# EAGLE design Board (EAGLE 7.1.0)
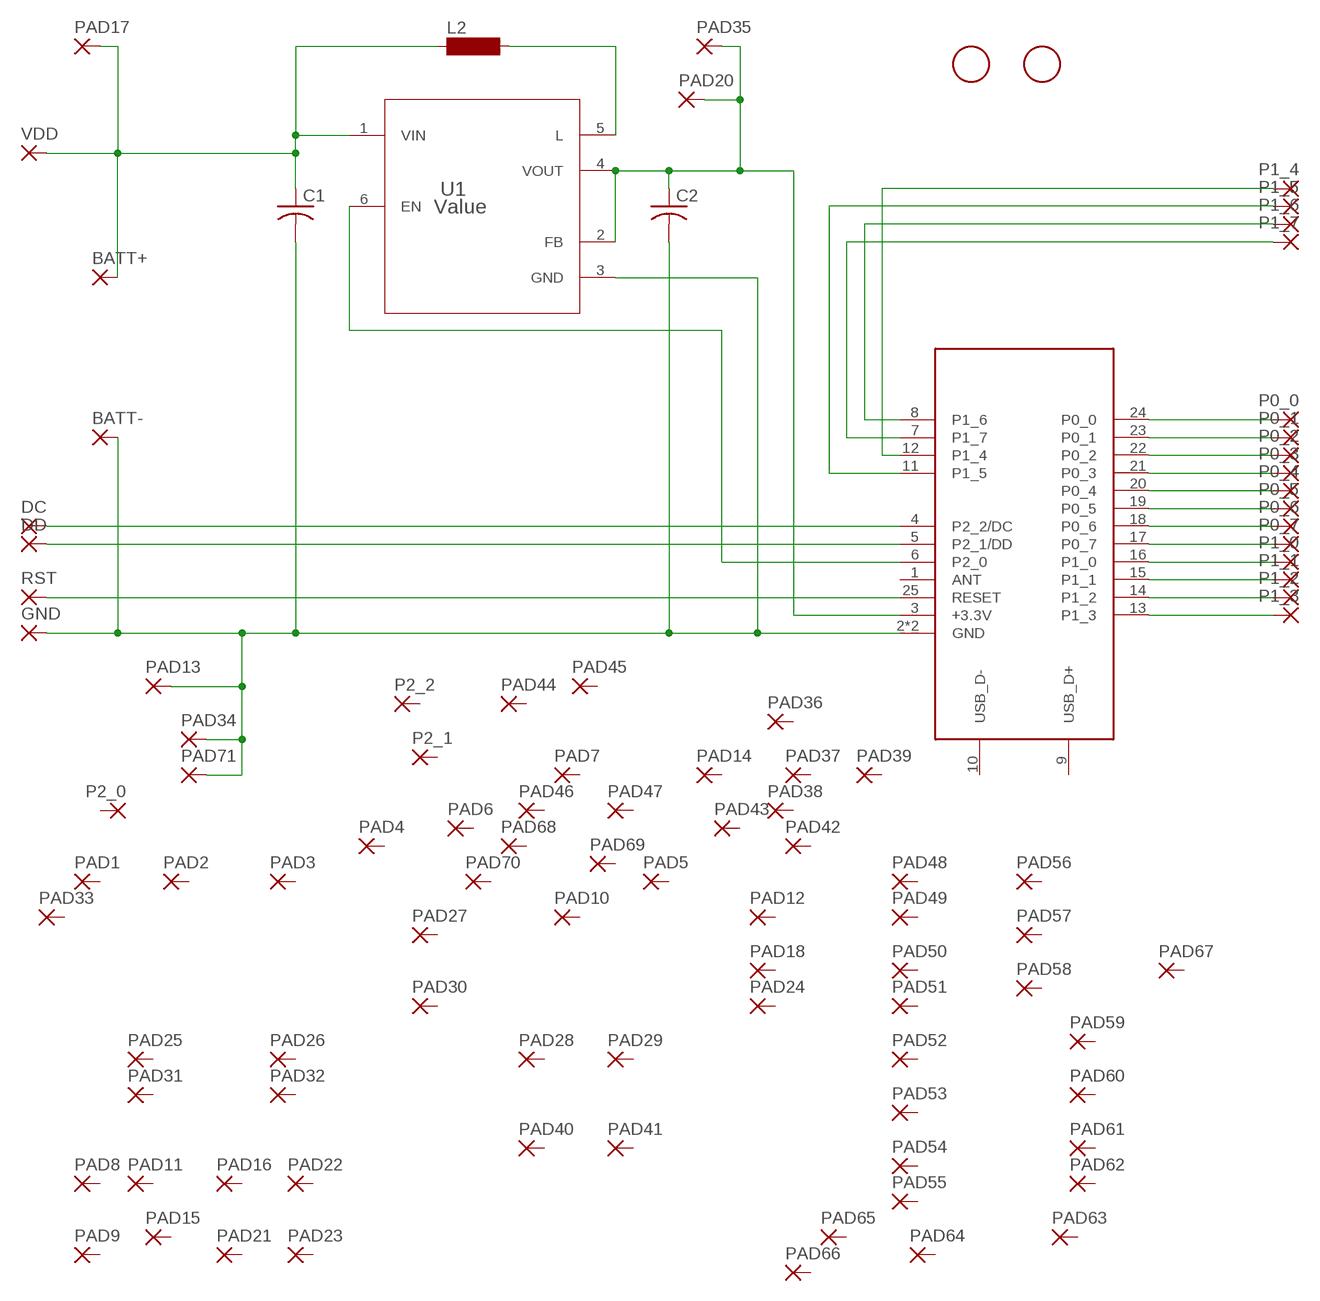
[diagram p0: schematic, sheet 1]

## Parts
BATT+  1,6/0,9  [1,6/0,9]
BATT-  1,6/0,9  [1,6/0,9]
C1  C-USC0603  [C0603]
C2  C-USC0603  [C0603]
DC  SMD2  [SMD1,27-2,54]
DD  SMD2  [SMD1,27-2,54]
E1  CC2540-MODULE-BOARD  [24X15_BOARD]
GND  SMD2  [SMD1,27-2,54]
L2  SM-NE29  [SM-NE29]
P0_0  1,6/0,9  [1,6/0,9]
P0_1  1,6/0,9  [1,6/0,9]
P0_2  1,6/0,9  [1,6/0,9]
P0_3  1,6/0,9  [1,6/0,9]
P0_4  1,6/0,9  [1,6/0,9]
P0_5  1,6/0,9  [1,6/0,9]
P0_6  1,6/0,9  [1,6/0,9]
P0_7  1,6/0,9  [1,6/0,9]
P1_0  1,6/0,9  [1,6/0,9]
P1_1  1,6/0,9  [1,6/0,9]
P1_2  1,6/0,9  [1,6/0,9]
P1_3  1,6/0,9  [1,6/0,9]
P1_4  1,6/0,9  [1,6/0,9]
P1_5  1,6/0,9  [1,6/0,9]
P1_6  1,6/0,9  [1,6/0,9]
P1_7  1,6/0,9  [1,6/0,9]
P2_0  1,6/0,9  [1,6/0,9]
P2_1  1,6/0,9  [1,6/0,9]
P2_2  1,6/0,9  [1,6/0,9]
PAD1  1,6/0,9  [1,6/0,9]
PAD2  1,6/0,9  [1,6/0,9]
PAD3  1,6/0,9  [1,6/0,9]
PAD4  1,6/0,9  [1,6/0,9]
PAD5  1,6/0,9  [1,6/0,9]
PAD6  1,6/0,9  [1,6/0,9]
PAD7  1,6/0,9  [1,6/0,9]
PAD8  1,6/0,9  [1,6/0,9]
PAD9  1,6/0,9  [1,6/0,9]
PAD10  1,6/0,9  [1,6/0,9]
PAD11  1,6/0,9  [1,6/0,9]
PAD12  1,6/0,9  [1,6/0,9]
PAD13  1,6/0,9  [1,6/0,9]
PAD14  1,6/0,9  [1,6/0,9]
PAD15  1,6/0,9  [1,6/0,9]
PAD16  1,6/0,9  [1,6/0,9]
PAD17  1,6/0,9  [1,6/0,9]
PAD18  1,6/0,9  [1,6/0,9]
PAD20  1,6/0,9  [1,6/0,9]
PAD21  1,6/0,9  [1,6/0,9]
PAD22  1,6/0,9  [1,6/0,9]
PAD23  1,6/0,9  [1,6/0,9]
PAD24  1,6/0,9  [1,6/0,9]
PAD25  1,6/0,9  [1,6/0,9]
PAD26  1,6/0,9  [1,6/0,9]
PAD27  1,6/0,9  [1,6/0,9]
PAD28  1,6/0,9  [1,6/0,9]
PAD29  1,6/0,9  [1,6/0,9]
PAD30  1,6/0,9  [1,6/0,9]
PAD31  1,6/0,9  [1,6/0,9]
PAD32  1,6/0,9  [1,6/0,9]
PAD33  1,6/0,9  [1,6/0,9]
PAD34  1,6/0,9  [1,6/0,9]
PAD35  1,6/0,9  [1,6/0,9]
PAD36  1,6/0,9  [1,6/0,9]
PAD37  1,6/0,9  [1,6/0,9]
PAD38  1,6/0,9  [1,6/0,9]
PAD39  1,6/0,9  [1,6/0,9]
PAD40  1,6/0,9  [1,6/0,9]
PAD41  1,6/0,9  [1,6/0,9]
PAD42  1,6/0,9  [1,6/0,9]
PAD43  1,6/0,9  [1,6/0,9]
PAD44  1,6/0,9  [1,6/0,9]
PAD45  1,6/0,9  [1,6/0,9]
PAD46  1,6/0,9  [1,6/0,9]
PAD47  1,6/0,9  [1,6/0,9]
PAD48  1,6/0,9  [1,6/0,9]
PAD49  1,6/0,9  [1,6/0,9]
PAD50  1,6/0,9  [1,6/0,9]
PAD51  1,6/0,9  [1,6/0,9]
PAD52  1,6/0,9  [1,6/0,9]
PAD53  1,6/0,9  [1,6/0,9]
PAD54  1,6/0,9  [1,6/0,9]
PAD55  1,6/0,9  [1,6/0,9]
PAD56  1,6/0,9  [1,6/0,9]
PAD57  1,6/0,9  [1,6/0,9]
PAD58  1,6/0,9  [1,6/0,9]
PAD59  1,6/0,9  [1,6/0,9]
PAD60  1,6/0,9  [1,6/0,9]
PAD61  1,6/0,9  [1,6/0,9]
PAD62  1,6/0,9  [1,6/0,9]
PAD63  1,6/0,9  [1,6/0,9]
PAD64  1,6/0,9  [1,6/0,9]
PAD65  1,6/0,9  [1,6/0,9]
PAD66  1,6/0,9  [1,6/0,9]
PAD67  1,6/0,9  [1,6/0,9]
PAD68  1,6/0,9  [1,6/0,9]
PAD69  1,6/0,9  [1,6/0,9]
PAD70  1,6/0,9  [1,6/0,9]
PAD71  1,6/0,9  [1,6/0,9]
RST  SMD2  [SMD1,27-2,54]
U1  Value  TPS61221DCKR  [DCK0006A]
U$1  FIDUCIAL  [FIDUCIAL_1MM]
U$2  FIDUCIAL  [FIDUCIAL_1MM]
VDD  SMD2  [SMD1,27-2,54]

## Nets
3V3: C2.1 E1.3(+3.3V) PAD20.1(P) PAD35.1(P) U1.2(FB) U1.4(VOUT)
DC: DC.1(P) E1.4(P2_2/DC)
DD: DD.1(P) E1.5(P2_1/DD)
GND: BATT-.1(P) C1.2 C2.2 E1.2(GND) E1.26(GND) GND.1(P) PAD13.1(P) PAD34.1(P) PAD71.1(P) U1.3(GND)
N$1: E1.18(P0_6) P0_6.1(P)
N$2: E1.17(P0_7) P0_7.1(P)
N$6: E1.13(P1_3) P1_3.1(P)
N$7: E1.14(P1_2) P1_2.1(P)
N$8: E1.15(P1_1) P1_1.1(P)
N$9: E1.21(P0_3) P0_3.1(P)
N$10: E1.20(P0_4) P0_4.1(P)
N$11: E1.19(P0_5) P0_5.1(P)
N$12: E1.16(P1_0) P1_0.1(P)
N$13: E1.7(P1_7) P1_7.1(P)
N$14: E1.8(P1_6) P1_6.1(P)
N$15: E1.11(P1_5) P1_5.1(P)
N$16: E1.12(P1_4) P1_4.1(P)
N$17: E1.6(P2_0) U1.6(EN)
N$18: E1.22(P0_2) P0_2.1(P)
N$22: L2.2 U1.5(L)
P0_0: E1.24(P0_0) P0_0.1(P)
P0_1: E1.23(P0_1) P0_1.1(P)
RST: E1.25(RESET) RST.1(P)
VDD: BATT+.1(P) C1.1 L2.1 PAD17.1(P) U1.1(VIN) VDD.1(P)
Unconnected: E1.1(ANT) E1.9(USB_D+) E1.10(USB_D-) P2_0.1(P) P2_1.1(P) P2_2.1(P) PAD1.1(P) PAD2.1(P) PAD3.1(P) PAD4.1(P) PAD5.1(P) PAD6.1(P) PAD7.1(P) PAD8.1(P) PAD9.1(P) PAD10.1(P) PAD11.1(P) PAD12.1(P) PAD14.1(P) PAD15.1(P) PAD16.1(P) PAD18.1(P) PAD21.1(P) PAD22.1(P) PAD23.1(P) PAD24.1(P) PAD25.1(P) PAD26.1(P) PAD27.1(P) PAD28.1(P) PAD29.1(P) PAD30.1(P) PAD31.1(P) PAD32.1(P) PAD33.1(P) PAD36.1(P) PAD37.1(P) PAD38.1(P) PAD39.1(P) PAD40.1(P) PAD41.1(P) PAD42.1(P) PAD43.1(P) PAD44.1(P) PAD45.1(P) PAD46.1(P) PAD47.1(P) PAD48.1(P) PAD49.1(P) PAD50.1(P) PAD51.1(P) PAD52.1(P) PAD53.1(P) PAD54.1(P) PAD55.1(P) PAD56.1(P) PAD57.1(P) PAD58.1(P) PAD59.1(P) PAD60.1(P) PAD61.1(P) PAD62.1(P) PAD63.1(P) PAD64.1(P) PAD65.1(P) PAD66.1(P) PAD67.1(P) PAD68.1(P) PAD69.1(P) PAD70.1(P)

## Library data of the parts
BATT+ BATT- P0_0 P0_1-P0_7 P1_0 P1_1-P1_7 P2_0 P2_1 P2_2 PAD1-PAD18 PAD20-PAD71 = pads:1,6/0,9: THROUGH-HOLE PAD
C1 C2 = Copies:C-US: CAPACITOR, American symbol
DC DD GND RST VDD = pads:SMD2: SMD PAD
E1 = CC254X-Modules:CC2540-MODULE: TI CC2541 Module
L2 = NR3015T4R7M:SM-NE29: INDUCTOR SMD chip inductor; OC_FARNELL: unknown; OC_NEWARK: unknown
U1 = tps61221:TPS61221DCKR; COMPTYPE: IC; MANUFACTURER: Texas Instruments; MOUNTTYPE: SMT; PACKAGEREFERENCE: DCK0006A; PARTNUMBER: TPS61221DCK; PIN_COUNT: 6; REFDES: RefDes; ROHS: Y; TYPE: TYPE
U$1 U$2 = Copies:FIDUCIAL: For use by pick and place machines to calibrate the vision/machine, 1mm By microbuilder.eu

## Board
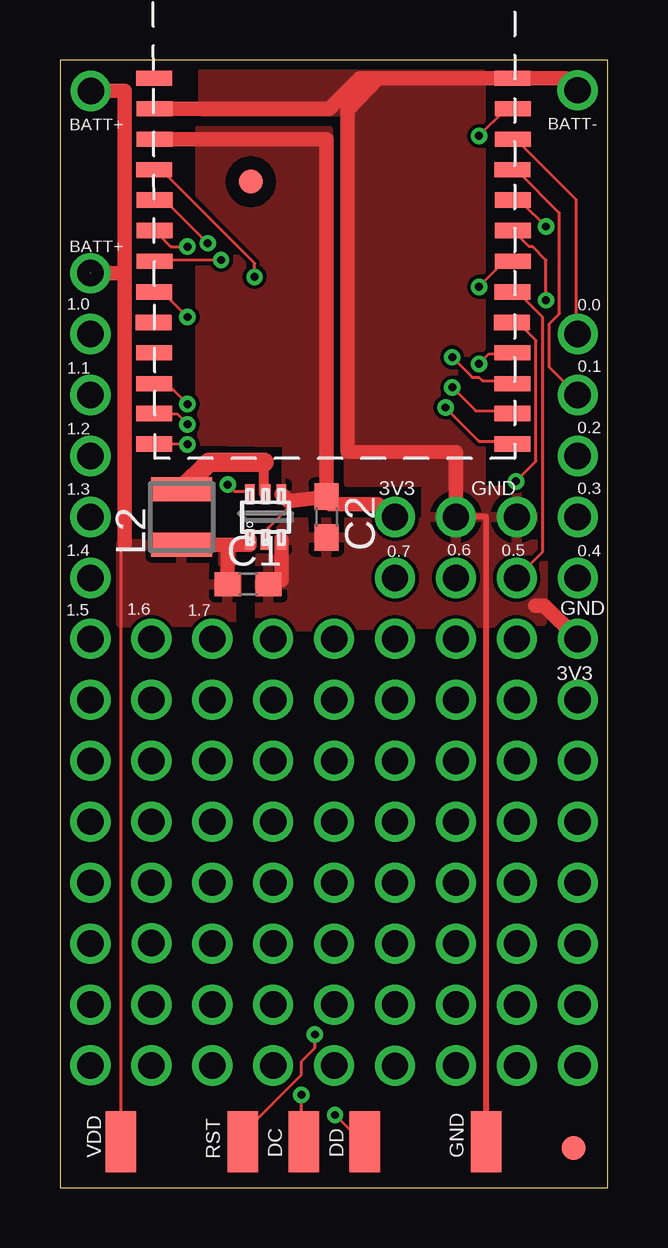
[diagram p1: board, top side]
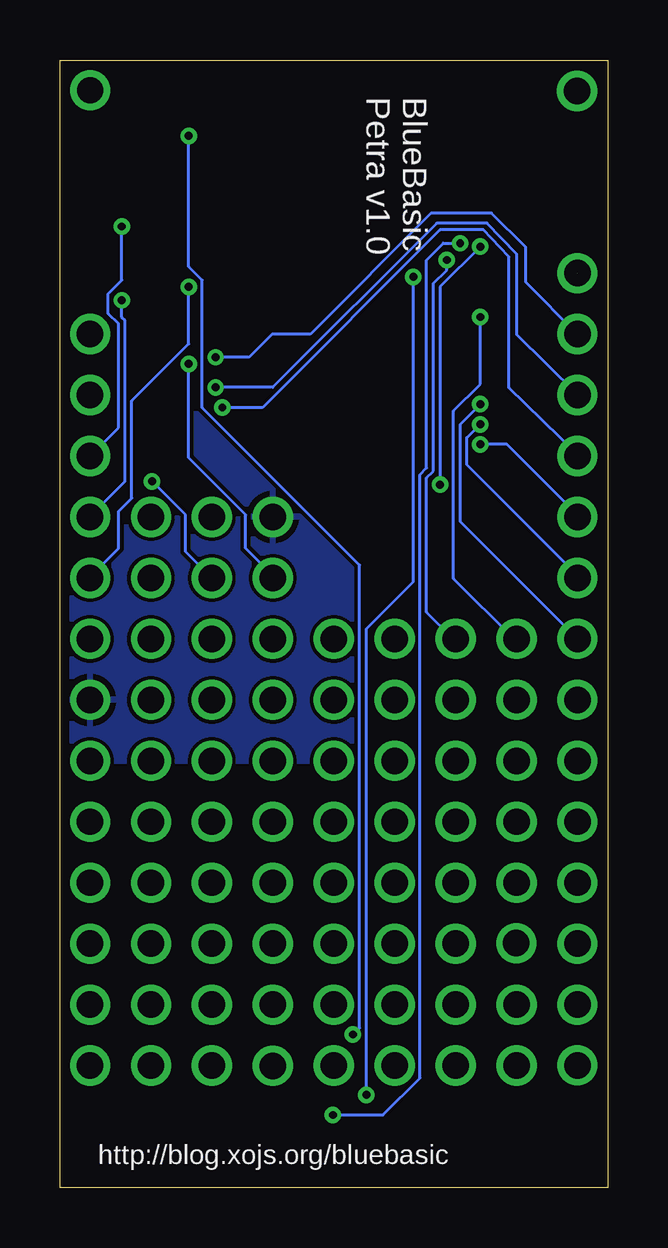
[diagram p2: board, bottom side, seen from below]

Size 22.85 x 46.98 mm. Coordinates in mm from the lower left corner, seen from the top.
Outline: 0,0 22.85,0 22.85,46.98 0,46.98 0,0
Copper layers (1*16): Top 0.0356mm / dielectric 1.5011mm / Bottom 0.0356mm
Design rules "LaenPCBOrder *": minimum track width 5mil, minimum drill 13mil, track to track 6mil, track to pad 6mil, pad to pad 6mil, via to via 6mil, smd to smd 6mil, copper to edge 15mil, drill to drill 6mil, minimum pad ring 7mil, minimum via ring 7mil, stop-mask expansion 3mil, vias tented up to drill 0.4mm, thermal gap 10mil
vRestrict: area 0.2,7.5 to 22.6,26.8

### Footprints (pad centres in the part's own frame; a part is rotated, then mirrored left to right if it is on the bottom)
1,6/0,9 = drill 1.1 pad 1.676: 1 0,0
C0603 = smd 1.1 x 1: 1 -0.85,0; 2 0.85,0
SMD1,27-2,54 = smd 1.27 x 2.54: 1 0,0
24X15_BOARD = smd 1.5 x 0.635: 1 -6.982,-1.16; 2 -6.973,-2.43; 3 -6.973,-3.7; 4 -6.982,-4.97; 5 -6.973,-6.23; 6 -6.973,-7.51; 7 -6.973,-8.79; 8 -6.982,-10.07; 9 -7.003,-11.34; 10 -6.982,-12.6; 11 -6.982,-13.89; 12 -6.982,-15.13; 13 -6.982,-16.4; 14 7.957,-16.4; 15 7.957,-15.13; 16 7.957,-13.89; 17 7.957,-12.6; 18 7.938,-11.34; 19 7.957,-10.07; 20 7.968,-8.79; 21 7.968,-7.51; 22 7.968,-6.23; 23 7.957,-4.97; 24 7.968,-3.7; 25 7.968,-2.43; 26 7.957,-1.16
SM-NE29 = smd 1 x 2.54: 1 -1.15,0; 2 1.15,0
DCK0006A = smd 0.838 x 0.406: 1 -0.94,0.66; 2 -0.94,0; 3 -0.94,-0.66; 4 0.94,-0.66; 5 0.94,0; 6 0.94,0.66
FIDUCIAL_1MM = smd 1 x 1: 1 0,0

### Placement (x,y rotation side)
BATT+  1.28,45.69 0 bottom
BATT-  21.59,45.72 0 bottom
C1  7.85,25.13 0 top
C2  11.11,27.94 270 top
DC  10.16,1.9 0 top
DD  12.7,1.9 0 top
E1  10.91,47.38 0 top
GND  17.78,1.9 0 top
L2  5.08,27.94 90 top
P0_0  21.59,35.56 0 top
P0_1  21.59,33.02 0 top
P0_2  21.59,30.48 0 top
P0_3  21.59,27.94 0 top
P0_4  21.59,25.4 0 top
P0_5  19.05,25.4 0 top
P0_6  16.51,25.4 0 top
P0_7  13.97,25.4 0 top
P1_0  1.27,35.56 0 top
P1_1  1.27,33.02 0 top
P1_2  1.27,30.48 180 top
P1_3  1.27,27.94 0 top
P1_4  1.27,25.4 0 top
P1_5  1.27,22.86 0 top
P1_6  3.81,22.86 0 top
P1_7  6.35,22.86 0 top
P2_0  16.51,12.7 0 top
P2_1  13.97,7.62 0 top
P2_2  19.05,20.32 0 top
PAD1  6.35,12.7 0 top
PAD2  8.89,12.7 0 top
PAD3  11.43,12.7 0 top
PAD4  13.97,12.7 0 top
PAD5  1.27,12.7 0 top
PAD6  13.97,10.16 0 top
PAD7  3.81,12.7 0 top
PAD8  6.35,7.62 0 top
PAD9  3.81,20.32 0 top
PAD10  1.27,17.78 0 top
PAD11  6.35,20.32 0 top
PAD12  11.43,10.16 0 top
PAD13  16.51,27.94 0 top
PAD14  19.05,17.78 0 top
PAD15  8.89,20.32 0 top
PAD16  21.59,17.78 0 top
PAD17  1.27,38.1 0 top
PAD18  1.27,15.24 0 top
PAD20  21.59,20.32 0 top
PAD21  16.51,22.86 0 top
PAD22  1.27,10.16 0 top
PAD23  11.43,5.08 0 top
PAD24  8.89,7.62 0 top
PAD25  11.43,7.62 0 top
PAD26  8.89,22.86 0 top
PAD27  16.51,7.62 0 top
PAD28  3.81,17.78 0 top
PAD29  8.89,17.78 0 top
PAD30  19.05,22.86 0 top
PAD31  3.81,15.24 0 top
PAD32  6.35,17.78 0 top
PAD33  11.43,22.86 0 top
PAD34  19.05,27.94 0 top
PAD35  13.97,27.94 0 top
PAD36  3.82,10.18 0 top
PAD37  1.27,5.09 0 top
PAD38  3.81,7.62 0 top
PAD39  3.81,5.08 0 top
PAD40  6.35,15.24 0 top
PAD41  8.89,15.24 0 top
PAD42  1.27,7.62 0 top
PAD43  13.97,5.07 0 top
PAD44  19.05,5.08 0 top
PAD45  19.05,7.62 0 top
PAD46  19.05,10.16 0 top
PAD47  21.59,12.7 0 top
PAD48  21.59,15.24 90 top
PAD49  16.51,5.08 90 top
PAD50  1.27,20.32 90 top
PAD51  13.97,22.86 90 top
PAD52  16.51,20.32 90 top
PAD53  16.51,17.78 90 top
PAD54  16.51,15.24 90 top
PAD55  6.35,5.08 90 top
PAD56  19.05,15.24 0 top
PAD57  19.05,12.7 0 top
PAD58  8.89,5.08 0 top
PAD59  8.89,10.16 90 top
PAD60  13.97,20.32 90 top
PAD61  13.97,17.78 90 top
PAD62  13.97,15.24 90 top
PAD63  16.51,10.16 90 top
PAD64  6.35,10.16 90 top
PAD65  11.43,20.32 90 top
PAD66  11.43,17.78 90 top
PAD67  11.43,15.24 90 top
PAD68  21.59,10.16 0 top
PAD69  21.59,7.62 0 top
PAD70  21.59,5.08 0 top
PAD71  21.59,22.86 0 top
RST  7.62,1.9 0 top
U1  8.57,27.94 90 top
U$1  7.96,41.91 0 top
U$2  21.42,1.65 0 top
VDD  2.54,1.9 0 top

### Tracks (layer width: path | path; a pad name or v marks a point on that pad's centre or on a via)
3V3
  Top 0.127: U1.2 8.67,27.05 8.67,27.47 9.51,28.31 9.52,28.59
  Top 0.61: E1.3 11.11,43.68 C2.1 | C2.1 11.27,28.48 13.27,28.48 13.77,27.98 PAD35.1 | C2.1 9.52,28.59 U1.4
  pour Top: 5.81,44.04 5.81,31.05 8.18,31.01 9.43,30.99 9.39,28.6 11.2,28.57 11.23,44.08 5.77,44.08
  pour Bottom: 8.89,33.02 22.77,33.02 22.77,17.78 8.87,17.78
DC  (via drill 0.33)
  Top 0.127: v8.12,37.95 8.12,38.51 4.34,42.28 4.06,42.28 E1.4 | v10.07,3.86 10.07,1.9 DC.1
  Bottom 0.127: v8.12,37.95 8.12,25.23 10.07,23.28 v10.07,3.86
DD  (via drill 0.33)
  Top 0.127: v6.16,39.34 4.48,41.02 4.06,41.02 E1.5 | v11.47,3.02 12.59,1.9 DD.1
  Bottom 0.127: v6.16,39.34 6.86,39.34 7.56,38.65 7.56,29.98 7.84,29.7 7.84,4.56 9.37,3.02 v11.47,3.02
GND
  Top 0.254: GND.1 17.78,27.94 PAD13.1
  Top 0.61: 13.27,46.22 E1.26 21.09,46.22 BATT-.1 | 13.27,46.22 12.51,46.22 11.24,44.95 E1.2 | PAD13.1 16.51,30.64 11.98,30.65 11.98,44.88 13.27,46.22 | U1.3 9.23,25.3 C1.2 | PAD71.1 20.2,24.25 19.83,24.25
  pour Top: 15.25,29.03 15.25,27.69 8.34,27.71 8.33,23.34 20.11,23.58 20.24,29.03
  pour Top: 5.96,46.48 17.6,46.48 17.6,26.82 15.2,26.82 15.28,29.34 11.98,29.34 11.9,44.78 5.93,44.78 5.93,46.52
N$1  (via drill 0.33)
  Top 0.127: v19.01,29.43 19.85,30.26 19.85,35.29 19.15,35.99 18.87,35.99 E1.18
  Bottom 0.127: v19.01,29.43 17.61,28.03 17.61,26.49 16.64,25.51 P0_6.1
N$2  (via drill 0.33)
  Top 0.127: v17.47,34.31 17.89,34.73 18.73,34.73 E1.17
  Bottom 0.127: v17.47,34.31 17.47,30.4 15.1,28.03 15.1,26.63 13.98,25.51 P0_7.1
N$6  (via drill 0.33)
  Top 0.127: v5.32,30.96 4.06,30.96 E1.13
  Bottom 0.127: v5.32,30.96 4.2,30.96 1.27,28.03 P1_3.1
N$7  (via drill 0.33)
  Top 0.127: v16.08,32.5 17.47,31.1 18.73,31.1 E1.14
  Bottom 0.127: v16.08,32.5 14.4,32.5 7,39.9 5.18,39.9 4.13,38.78 4.13,33.33 1.27,30.54 P1_2.1
N$8  (via drill 0.33)
  Top 0.127: v16.36,33.34 17.34,32.36 18.73,32.36 E1.15
  Bottom 0.127: v16.36,33.34 13.98,33.34 7.14,40.18 5.04,40.18 3.8,38.89 3.8,35.54 1.27,33.06 P1_1.1
N$9  (via drill 0.33)
  Top 0.127: v20.27,36.97 20.27,38.65 19.71,39.2 19.57,39.2 19.01,39.76 E1.21
  Bottom 0.127: v20.27,36.97 20.27,36.27 20.13,36.13 20.13,29.43 21.53,28.03 P0_3.1
N$10  (via drill 0.33)
  Top 0.127: 18.77,38.48 E1.20 18.73,38.51 18.45,38.51 v17.47,37.53 | 21.52,25.48 P0_4.1
  Bottom 0.127: v17.47,37.53 17.47,35.15 19.85,32.78 19.85,28.73 20.41,28.17 20.41,26.63 21.53,25.51 P0_4.1
N$11
  Top 0.127: E1.19 18.87,37.25 19.15,37.25 20.13,36.27 20.13,26.49 19.15,25.51 P0_5.1
N$12  (via drill 0.33)
  Top 0.127: v16.36,34.59 17.2,33.76 17.47,33.76 17.61,33.62 18.73,33.62 E1.16
  Bottom 0.127: P1_0.1 3.43,37.72 3.43,39.18 4.85,40.6 7.37,40.6 12.41,35.56 13.97,35.56 13.98,35.57 14.96,34.59 v16.36,34.59
N$13  (via drill 0.33)
  Top 0.127: v6.72,38.65 4.06,38.65 E1.7
  Bottom 0.127: v6.72,38.65 6.72,38.23 7.28,37.67 7.28,29.84 7.56,29.57 7.56,23.98 6.44,22.86 P1_7.1
N$14  (via drill 0.33)
  Top 0.127: v5.32,36.27 4.34,37.25 4.06,37.25 E1.8
  Bottom 0.127: v5.32,36.27 5.32,33.48 6.44,32.36 6.44,25.38 3.92,22.86 P1_6.1
N$15  (via drill 0.33)
  Top 0.127: v5.32,32.64 4.48,33.48 4.06,33.48 E1.11
  Bottom 0.127: v5.32,32.64 6.16,31.8 6.16,27.75 P1_5.1
N$16  (via drill 0.33)
  Top 0.127: v5.32,31.8 4.9,32.22 4.06,32.22 E1.12
  Bottom 0.127: v5.32,31.8 5.88,31.24 5.88,30.12 1.27,25.51 P1_4.1
N$17  (via drill 0.33)
  Top 0.127: v7,29.29 7.28,29.01 7.84,29.01 U1.6 | v5.32,39.2 4.62,39.2 4.06,39.76 E1.6
  Bottom 0.127: v7,29.29 7,37.53 v5.32,39.2
N$18  (via drill 0.33)
  Top 0.127: 21.52,30.48 P0_2.1 | 19.02,41.23 E1.22 19.01,41.02 19.29,41.02 v20.27,40.04
  Bottom 0.127: v20.27,40.04 20.27,37.81 20.83,37.25 20.83,36.41 20.41,35.99 20.41,31.66 P0_2.1
N$22
  Top 0.406: U1.5 8.52,28.88 8.52,30.23
  Top 0.813: 8.52,30.23 6.22,30.23 L2.2
P0_0
  Top 0.127: E1.24 19.01,43.67 21.53,41.16 21.53,35.57 P0_0.1
P0_1
  Top 0.127: E1.23 18.87,42.28 19.15,42.28 20.83,40.6 20.83,36.41 20.41,35.99 20.41,34.18 21.53,33.06 P0_1.1
RST  (via drill 0.33)
  Top 0.127: v17.47,43.81 18.59,44.93 18.87,44.93 E1.25 | v10.63,6.38 10.63,5.82 10.07,5.26 10.07,4.7 7.7,2.32 7.7,1.9 RST.1
  Bottom 0.127: v17.47,43.81 17.47,38.37 16.92,37.81 16.92,32.5 10.35,25.93 10.35,6.65 v10.63,6.38
VDD  (1 unrouted)
  Top 0.127: VDD.1 2.53,1.9 2.53,26.63 2.7,26.82
  Top 0.61: U1.1 7.91,26.79 L2.1 7,26.79 C1.1 | BATT+.1 2.7,45.69 2.7,38.1 | 2.7,38.1 2.7,26.82 | 1.28,38.1 2.7,38.1
  pour Top: 2.55,26.84 7.13,26.79 7.14,23.58 2.55,23.52

### Text on the board
tPlace: BATT+ | BATT- | BATT+ | 1.0 | 0.0 | 1.1 | 0.1 | 1.2 | 0.2 | 1.3 | 3V3 | GND | 0.3 | 1.4 | 0.7 | 0.6 | 0.5 | 0.4 | 1.5 | 1.6 | 1.7 | GND | 3V3 | VDD | RST | DC | DD | GND
bPlace: BlueBasic / Petra v1.0 | http://blog.xojs.org/bluebasic